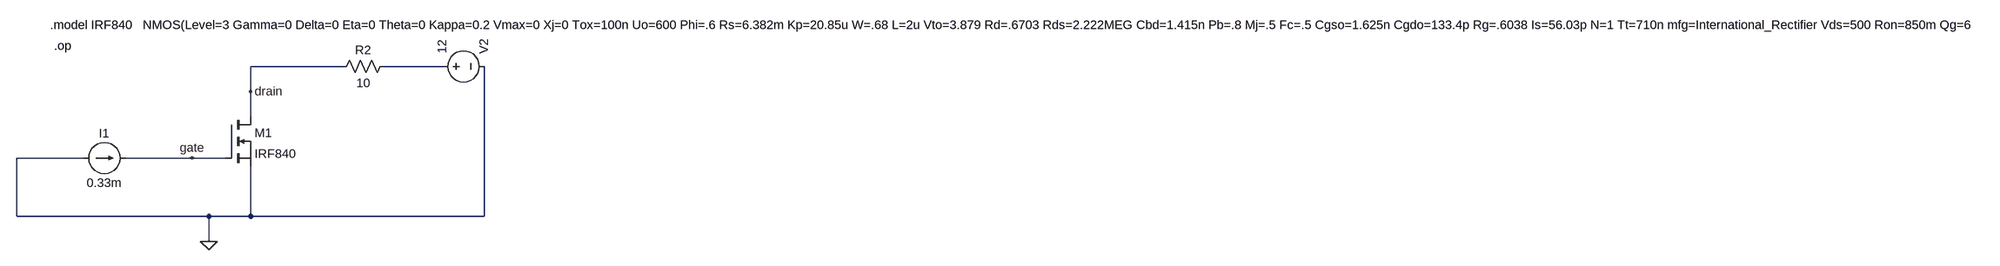
[diagram p0: schematic Atuador_irf840.asc]
Atuador_irf840.asc, the LTspice schematic file:
Version 4
SHEET 1 4128 680
WIRE 608 112 432 112
WIRE 800 112 688 112
WIRE 432 160 432 112
WIRE 432 208 432 160
WIRE 112 288 -16 288
WIRE 320 288 192 288
WIRE 384 288 320 288
WIRE -16 400 -16 288
WIRE 352 400 -16 400
WIRE 432 400 432 304
WIRE 432 400 352 400
WIRE 880 400 880 112
WIRE 880 400 432 400
WIRE 352 448 352 400
FLAG 352 448 0
FLAG 320 288 gate
FLAG 432 160 drain
SYMBOL nmos 384 208 R0
SYMATTR InstName M1
SYMATTR Value IRF840
SYMBOL voltage 784 112 R270
WINDOW 0 24 96 Left 2
WINDOW 3 24 16 Left 2
WINDOW 123 0 0 Left 0
WINDOW 39 0 0 Left 0
SYMATTR InstName V2
SYMATTR Value 12
SYMBOL res 704 96 R90
WINDOW 0 0 56 VBottom 2
WINDOW 3 32 56 VTop 2
SYMATTR InstName R2
SYMATTR Value 10
SYMBOL current 112 288 R270
WINDOW 0 32 40 VTop 2
WINDOW 3 -32 40 VBottom 2
WINDOW 123 0 0 Left 0
WINDOW 39 0 0 Left 0
SYMATTR InstName I1
SYMATTR Value 0.33m
TEXT 48 32 Left 2 !.model IRF840   NMOS(Level=3 Gamma=0 Delta=0 Eta=0 Theta=0 Kappa=0.2 Vmax=0 Xj=0 Tox=100n Uo=600 Phi=.6 Rs=6.382m Kp=20.85u W=.68 L=2u Vto=3.879 Rd=.6703 Rds=2.222MEG Cbd=1.415n Pb=.8 Mj=.5 Fc=.5 Cgso=1.625n Cgdo=133.4p Rg=.6038 Is=56.03p N=1 Tt=710n mfg=International_Rectifier Vds=500 Ron=850m Qg=63n)
TEXT 56 72 Left 2 !.op

The netlist it stands for:
* Atuador_irf840.asc
M1 drain gate 0 0 IRF840
V2 N001 0 12
R2 N001 drain 10
I1 0 gate 0.33m
.model NMOS NMOS
.model PMOS PMOS
.lib standard.mos
.model IRF840   NMOS(Level=3 Gamma=0 Delta=0 Eta=0 Theta=0 Kappa=0.2 Vmax=0 Xj=0 Tox=100n Uo=600 Phi=.6 Rs=6.382m Kp=20.85u W=.68 L=2u Vto=3.879 Rd=.6703 Rds=2.222MEG Cbd=1.415n Pb=.8 Mj=.5 Fc=.5 Cgso=1.625n Cgdo=133.4p Rg=.6038 Is=56.03p N=1 Tt=710n mfg=International_Rectifier Vds=500 Ron=850m Qg=63n)
.op
.backanno
.end